# EasyEDA schematic SIT210- Project.json
TITLE: Project Schematic; REV: 1.0; Date: 2020-06-03; Sheet: 1/1; Drawn By: ekgriffin
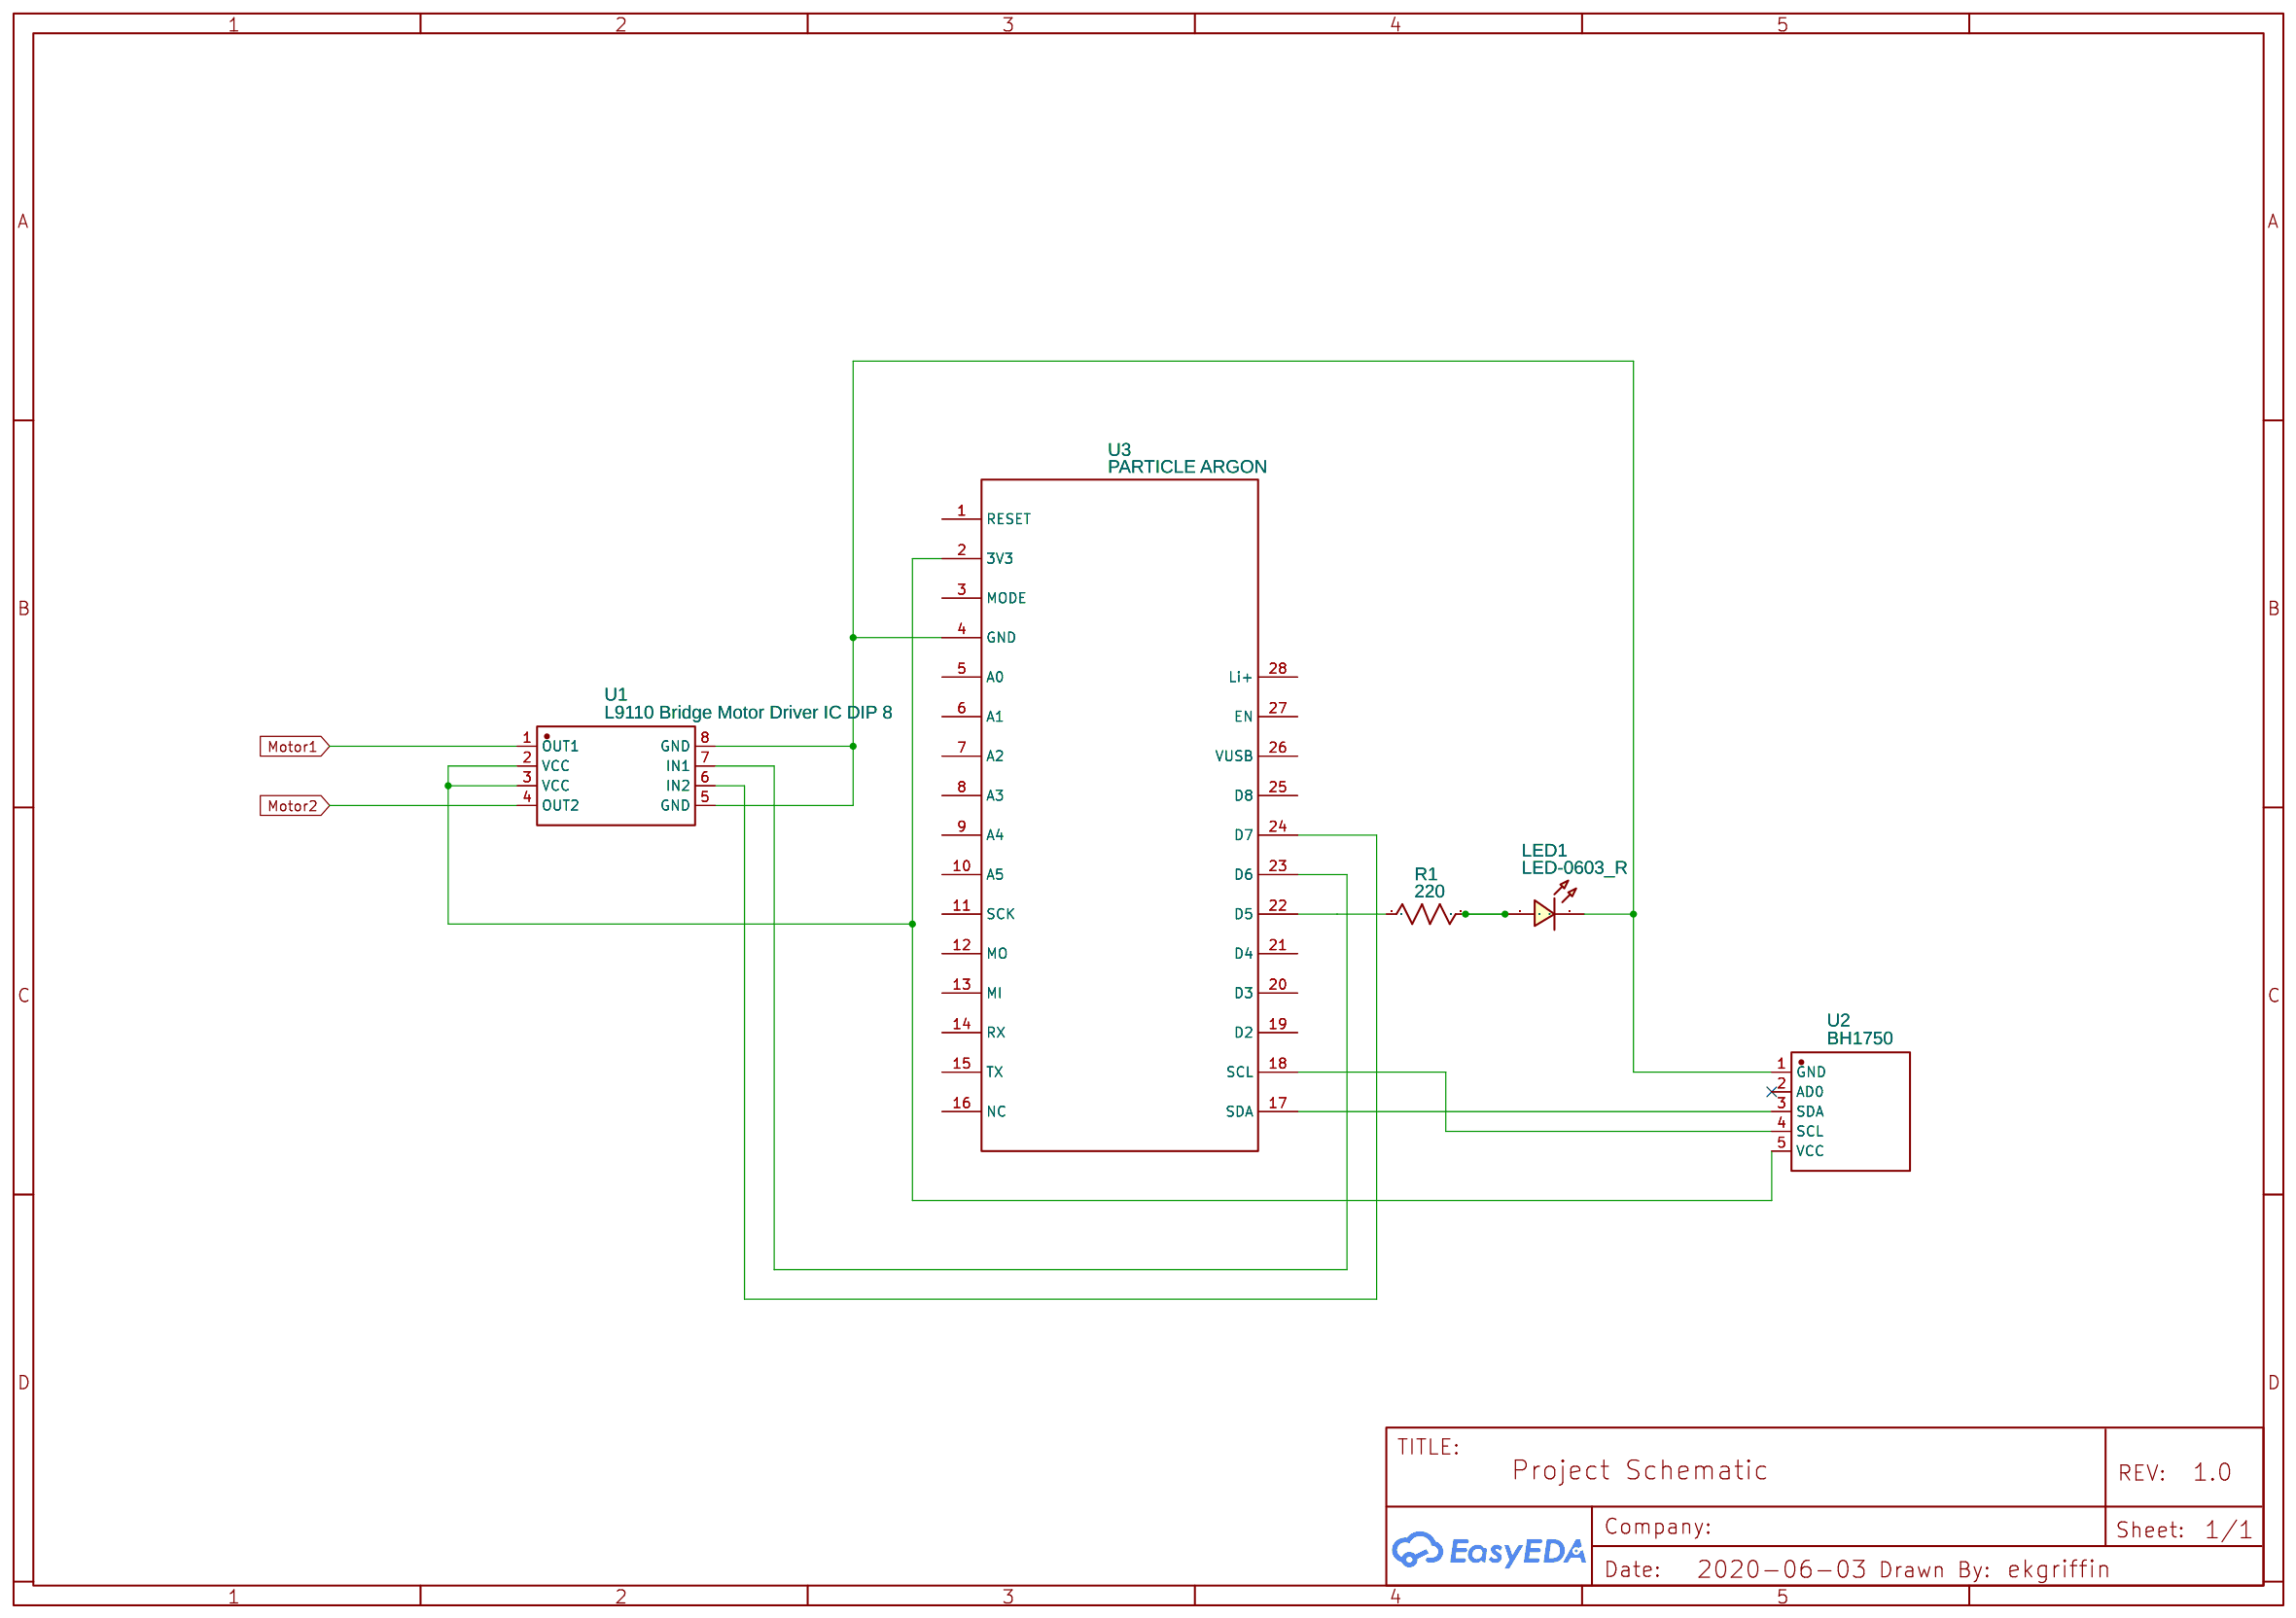
[diagram p0: schematic sheet]

## Parts
LED1  LED-0603_R  [LED0603_RED]
R1  220  [R0201]
U1  L9110 Bridge Motor Driver IC DIP 8  [ESOP-8_L4.9-W3.9-P1.27-LS5.8-BL]
U2  BH1750  [GY-30]
U3  PARTICLE ARGON  [PARTICLE_XENON]

## Library data of the parts
LED1 = LED-0603_R: Manufacturer: EVERLIGHT(台湾亿光); Manufacturer Part: 19-217/R6C-AL1M2VY/3T; Supplier Part: C72044; Supplier: LCSC; Contributor: LCEDA_01
R1 = R_0201_US: Contributor: LCEDA_Lib
U1 = L9110 Bridge Motor Driver IC DIP 8: Supplier: LCSC; Supplier Part: C490111; Manufacturer: Runjet; Manufacturer Part: RJDR8837; Contributor: ekgriffin
U2 = BH1750: Manufacturer Part: New SchematicLib; Contributor: micfort; Supplier: Tinytronics
U3 = PARTICLE ARGON: Contributor: farm21

## Nets
Motor1: U1.1(OUT1)
Motor2: U1.4(OUT2)
Net-(LED1-1): LED1.1 R1.2
Net-(LED1-2): LED1.2 U1.5(GND) U1.8(GND) U2.1(GND) U3.4(GND)
Net-(R1-1): R1.1 U3.22(D5)
Net-(U1-2): U1.2(VCC) U1.3(VCC) U2.5(VCC) U3.2(3V3)
Net-(U1-6): U1.6(IN2) U3.24(D7)
Net-(U1-7): U1.7(IN1) U3.23(D6)
Net-(U2-3): U2.3(SDA) U3.17(SDA)
Net-(U2-4): U2.4(SCL) U3.18(SCL)

Not connected (* = marked no-connect by the designer): U2 2(AD0)*; U3 1(RESET) 3(MODE) 5(A0) 6(A1) 7(A2) 8(A3) 9(A4) 10(A5) 11(SCK) 12(MO) 13(MI) 14(RX) 15(TX) 16(NC) 19(D2) 20(D3) 21(D4) 25(D8) 26(VUSB) 27(EN) 28(Li+)
